# EAGLE design Power Reg (EAGLE 7.2.0)
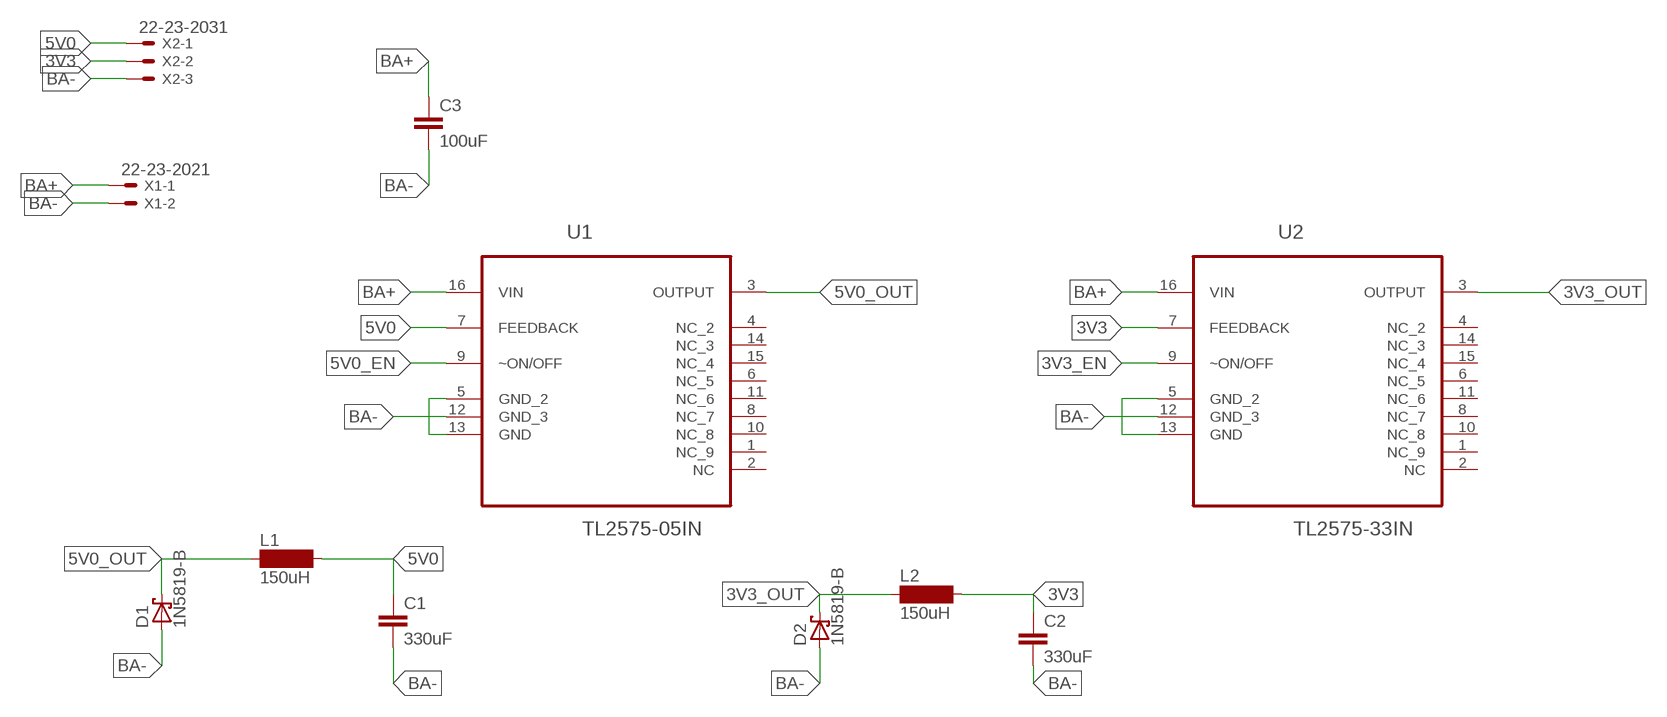
[diagram p0: schematic, sheet 1]

## Parts
C1  330uF  C5/3.5  [C5B3.5]
C2  330uF  C5/3.5  [C5B3.5]
C3  100uF  C5/3.5  [C5B3.5]
D1  1N5819-B  [DO41-7.6]
D2  1N5819-B  [DO41-7.6]
L1  150uH  SD8  [SD8]
L2  150uH  SD8  [SD8]
U1  TL2575-05IN  [DIP254P762X508-16]
U2  TL2575-33IN  [DIP254P762X508-16]
X1  22-23-2021  [22-23-2021]
X2  22-23-2031  [22-23-2031]

## Nets
3V3: C2.1 L2.2 U2.7(FEEDBACK) X2.2
3V3_EN: U2.9(~ON/OFF)
3V3_OUT: D2.C L2.1 U2.3(OUTPUT)
5V0: C1.1 L1.2 U1.7(FEEDBACK) X2.1
5V0_EN: U1.9(~ON/OFF)
5V0_OUT: D1.C L1.1 U1.3(OUTPUT)
BA+: C3.1 U1.16(VIN) U2.16(VIN) X1.1
BA-: C1.2 C2.2 C3.2 D1.A D2.A U1.5(GND_2) U1.12(GND_3) U1.13(GND) U2.5(GND_2) U2.12(GND_3) U2.13(GND) X1.2 X2.3
Unconnected: U1.1(NC_9) U1.2(NC) U1.4(NC_2) U1.6(NC_5) U1.8(NC_7) U1.10(NC_8) U1.11(NC_6) U1.14(NC_3) U1.15(NC_4) U2.1(NC_9) U2.2(NC) U2.4(NC_2) U2.6(NC_5) U2.8(NC_7) U2.10(NC_8) U2.11(NC_6) U2.14(NC_3) U2.15(NC_4)

## Library data of the parts
C1-C3 = capacitor-wima:C: CAPACITOR naming: grid - package width
D1 D2 = diode:1N581*: 1.0A SCHOTTKY BARRIER RECTIFIER Source: http://www.diodes.com/datasheets/ds23001.pdf
L1 L2 = inductor-neosid:SD8: INDUCTOR nominal inductance; OC_FARNELL: unknown; OC_NEWARK: unknown
U1 = baja:TL2575-05IN: 1-A SIMPLE STEP-DOWN SWITCHING VOLTAGE REGULATORS; MPN: TL2575HV-05IN; OC_FARNELL: -; OC_NEWARK: 27M1040; PACKAGE: PDIP-16; SUPPLIER: Texas Instruments
U2 = baja:TL2575-33IN: 1-A SIMPLE STEP-DOWN SWITCHING VOLTAGE REGULATORS; MPN: TL2575HV-05IN; OC_FARNELL: -; OC_NEWARK: 27M1040; PACKAGE: PDIP-16; SUPPLIER: Texas Instruments
X1 = con-molex:22-23-2021: .100" (2.54mm) Center Header - 2 Pin; MF: MOLEX; MPN: 22-23-2021; OC_FARNELL: 1462926; OC_NEWARK: 25C3832
X2 = con-molex:22-23-2031: .100" (2.54mm) Center Header - 3 Pin; MF: MOLEX; MPN: 22-23-2031; OC_FARNELL: 1462950; OC_NEWARK: 30C0862

## Board
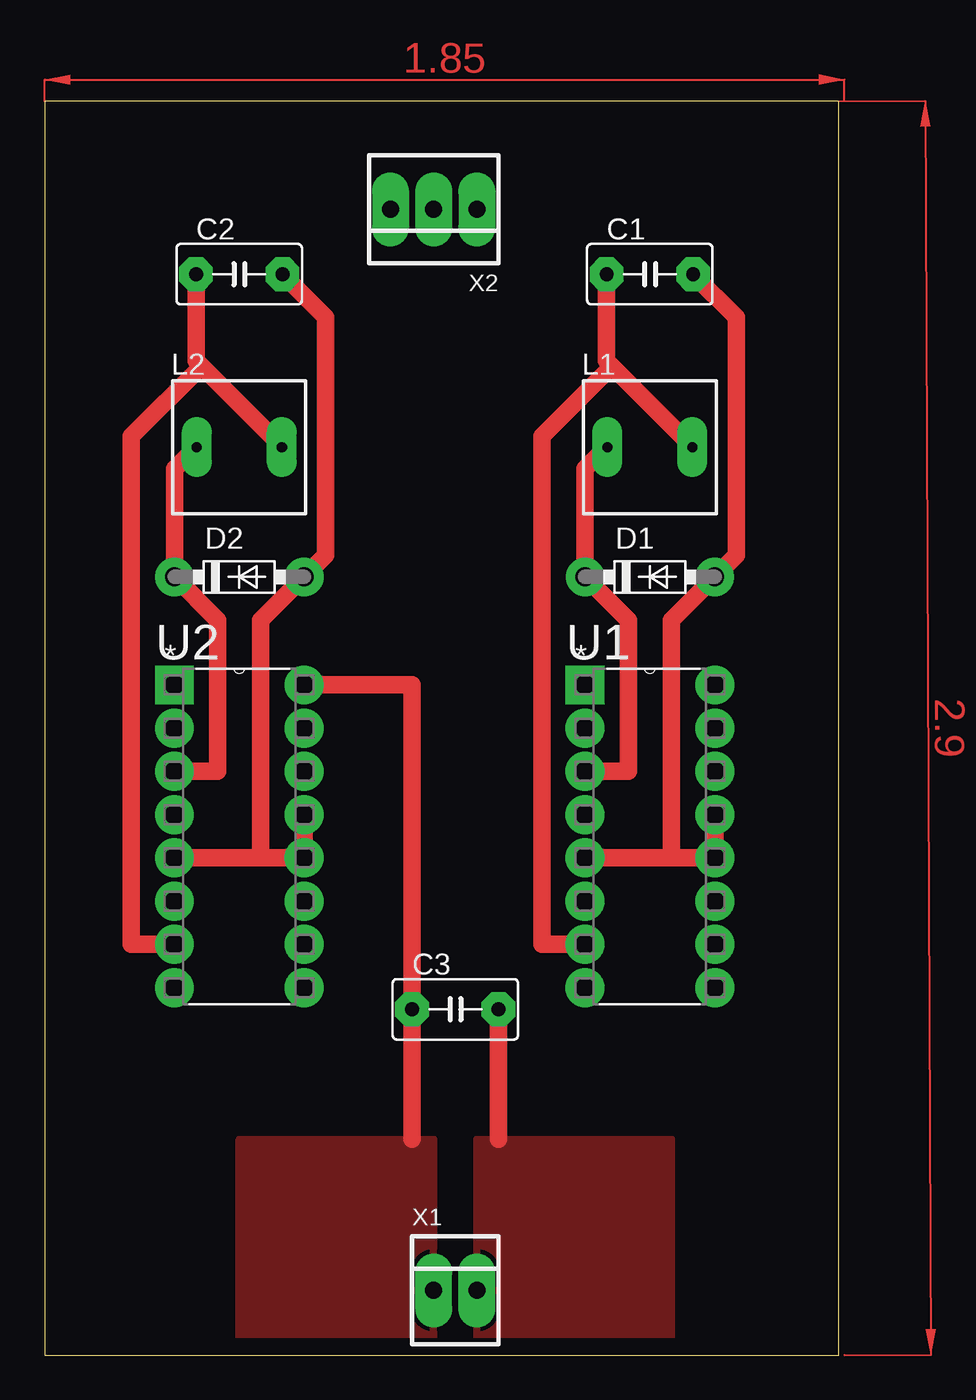
[diagram p1: board, top side]
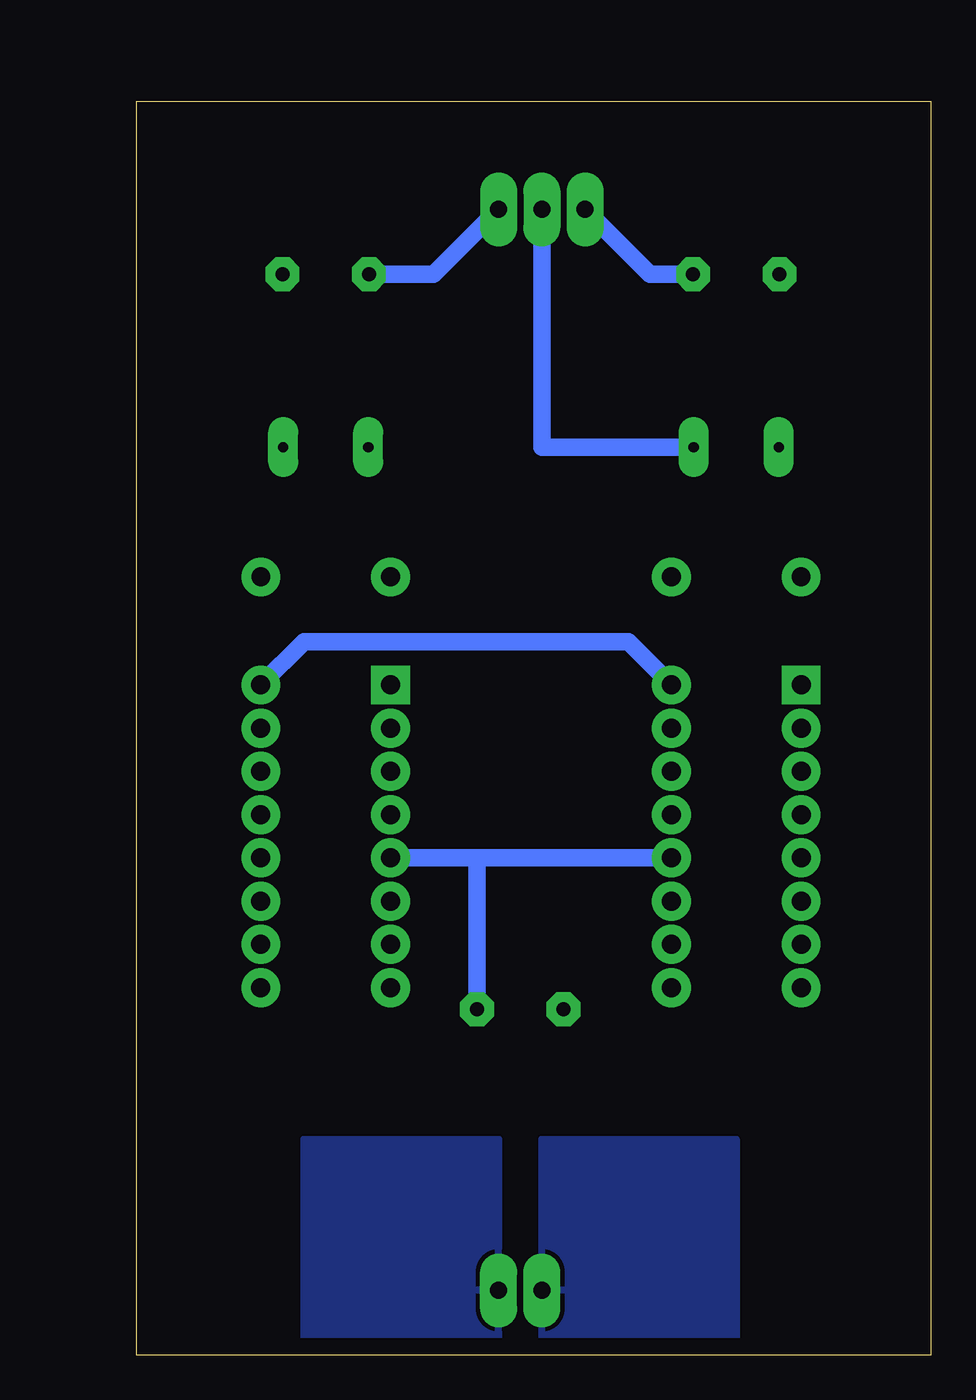
[diagram p2: board, bottom side, seen from below]

Size 46.66 x 73.65 mm. Coordinates in mm from the lower left corner, seen from the top.
Outline: 0,0 46.66,0 46.66,73.65 0,73.65 0,0
Copper layers (1*16): Top 0.035mm / dielectric 1.5mm / Bottom 0.035mm
Design rules "default *": minimum track width 40mil, minimum drill 24mil, track to track 40mil, track to pad 40mil, pad to pad 40mil, via to via 40mil, smd to smd 8mil, copper to edge 40mil, drill to drill 40mil, minimum pad ring 23mil, minimum via ring 23mil, stop-mask expansion 4mil, vias tented up to drill 0mil, thermal gap 10mil

### Footprints (pad centres in the part's own frame; a part is rotated, then mirrored left to right if it is on the bottom)
C5B3.5 = drill 0.813 pad 1.6 octagon: 1 -2.54,0; 2 2.54,0
DO41-7.6 = drill 1.1 pad 1.7: A 3.81,0; C -3.81,0
SD8 = drill 0.6 long: 1 -2.5,0; 2 2.5,0
DIP254P762X508-16 = drill 1.118 square: 1 -7.62,17.78 | drill 1.118: 2 -7.62,15.24; 3 -7.62,12.7; 4 -7.62,10.16; 5 -7.62,7.62; 6 -7.62,5.08; 7 -7.62,2.54; 8 -7.62,0; 9 0,0; 10 0,2.54; 11 0,5.08; 12 0,7.62; 13 0,10.16; 14 0,12.7; 15 0,15.24; 16 0,17.78
22-23-2021 = drill 1 long: 1 -1.27,0; 2 1.27,0
22-23-2031 = drill 1 long: 1 -2.54,0; 2 0,0; 3 2.54,0

### Placement (x,y rotation side)
C1  35.56,63.5 0 top
C2  11.43,63.5 0 top
C3  24.13,20.32 0 top
D1  35.56,45.72 0 top
D2  11.43,45.72 0 top
L1  35.56,53.34 0 top
L2  11.43,53.34 0 top
U1  39.37,21.59 0 top
U2  15.24,21.59 0 top
X1  24.13,3.81 0 top
X2  22.86,67.31 180 top

### Tracks (layer width: path | path; a pad name or v marks a point on that pad's centre or on a via)
3V3
  Top 1.016: 9.21,58.1 8.89,58.42 C2.1 | 9.21,58.1 13.97,53.34 L2.2 | U2.7 5.08,24.13 5.08,53.98 9.21,58.1
  Bottom 1.016: X2.2 22.86,53.34 L2.2
3V3_OUT
  Top 1.016: L2.1 8.89,53.34 7.62,52.07 D2.C 10.16,43.18 10.16,34.29 U2.3
5V0
  Top 1.016: 33.34,58.1 33.02,58.42 C1.1 | 33.34,58.1 38.1,53.34 L1.2 | U1.7 29.21,24.13 29.21,53.98 33.34,58.1
  Bottom 1.016: X2.1 29.21,63.5 C1.1
5V0_OUT
  Top 1.016: L1.1 33.02,53.34 31.75,52.07 D1.C 34.29,43.18 34.29,34.29 U1.3
BA+
  Top 1.016: 21.59,12.7 C3.1 21.59,39.37 U2.16
  Bottom 1.016: U1.16 36.83,41.91 17.78,41.91 U2.16
  pour Top: 11.43,0 11.43,12.7 22.86,12.7 22.86,0
  pour Bottom: 11.43,12.7 11.43,0 22.86,0 22.86,12.7
BA-
  Top 1.016: 12.7,29.21 U2.12 U2.13 | 12.7,29.21 U2.5 | 12.7,29.21 12.7,43.18 D2.A 16.51,46.99 16.51,60.96 C2.2 | C1.2 40.64,60.96 40.64,46.99 D1.A 36.83,43.18 36.83,29.21 | 26.67,12.7 C3.2 | 36.83,29.21 U1.12 U1.13 | 36.83,29.21 U1.5
  Bottom 1.016: X2.3 16.51,63.5 C2.2 | 26.67,29.21 C3.2 | U1.5 26.67,29.21 | 26.67,29.21 U2.12
  pour Top: 36.83,0 25.4,0 25.4,12.7 36.83,12.7
  pour Bottom: 25.4,12.7 25.4,0 36.83,0 36.83,12.7
(copper drawn outside any net)
  shapes: Top area x2